# Altium project PCB_Project.PrjPcb
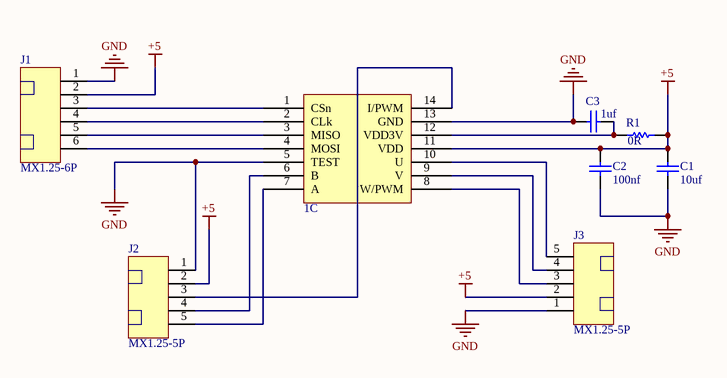
[diagram p0: Sheet1.SchDoc]
1 sheet, 8 parts. Net scope: global (net labels, ports and power ports of the same name join across sheets).
Board file: PCB1.PcbDoc

## Sheet Sheet1.SchDoc
size A4

### Parts
1  AS5147P  [TSSOP14MAX]  (value not drawn)  (part C of 3)
C1  value 10uf  [0805C]  (hidden comment: Cap)
C2  value 100nf  [0603C]  (hidden comment: Cap)
C3  value 1uf  [0603C]  (hidden comment: Cap)
J1  MX1.25-6P  [MX1.25-6P]
J2  MX1.25-5P  [MX1.25-5P]
J3  MX1.25-5P  [MX1.25-5P]
R1  value 0R  [0603R]  (hidden comment: Res1)

### Nets
+5: 1.11(VDD) C1.2 C2.2 J1.2 J2.2 J3.2 R1.2
GND: 1.5(TEST) 1.13(GND) C1.1 C2.1 C3.2 J1.1 J2.1 J3.1
Net1_1: 1.1(CSn) J1.3
Net1_2: 1.2(CLk) J1.4
Net1_3: 1.3(MISO) J1.5
Net1_4: 1.4(MOSI) J1.6
Net1_6: 1.6(B) J2.4
Net1_7: 1.7(A) J2.5
Net1_8: 1.8(W/PWM) J3.3
Net1_9: 1.9(V) J3.4
Net1_10: 1.10(U) J3.5
Net1_12: 1.12(VDD3V) C3.1 R1.1
Net1_14: 1.14(I/PWM) J2.3

### Library data of the parts
C1-C3 = Cap: Capacitor; Published: 8-Jun-2000; LatestRevisionDate: 17-Jul-2002; LatestRevisionNote: Re-released for DXP Platform.; PackageReference: RAD-0.3; Publisher: Altium Limited; PackageDescription: Radial Cap, Thru-Hole; 2 Leads; 0.3 in Pin Spacing
R1 = Res1: Resistor; Published: 8-Jun-2000; LatestRevisionDate: 17-Jul-2002; LatestRevisionNote: Re-released for DXP Platform.; PackageReference: AXIAL-0.3; Publisher: Altium Limited; PackageDescription: Axial Device, Thru-Hole; 2 Leads; 0.3 in Pin Spacing